# EAGLE design motor-driver-VNH23P30 TH (EAGLE 6.5.0)
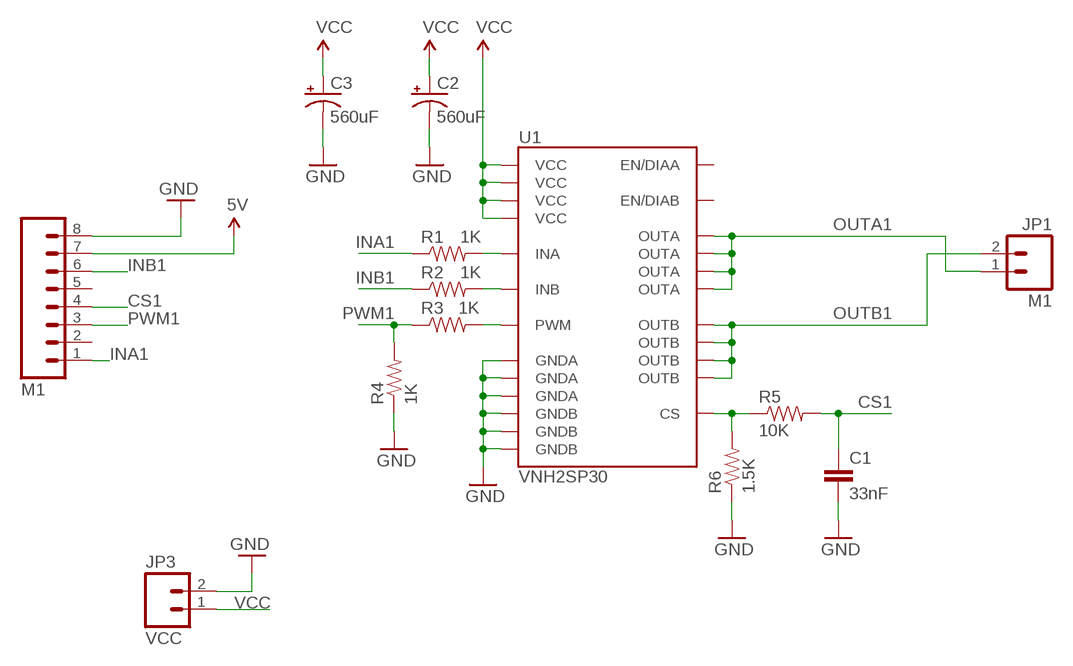
[diagram p0: schematic, sheet 1]

## Parts
C1  33nF  CAPEZ  [CAP-PTH-SMALLEZ]
C2  560uF  CAP_POLPTH4  [CPOL-RADIAL-1000UF-25V]
C3  560uF  CAP_POLPTH4  [CPOL-RADIAL-1000UF-25V]
JP1  M1  M02PTH4  [1X02_XTRA_BIG]
JP3  VCC  M02PTH4  [1X02_XTRA_BIG]
P  M1  M081X08  [1X08]
R1  1K  RESISTORPTH-1/6W  [1/6W-RES]
R2  1K  RESISTORPTH-1/6W  [1/6W-RES]
R3  1K  RESISTORPTH-1/6W  [1/6W-RES]
R4  1K  RESISTORPTH-1/6W  [1/6W-RES]
R5  10K  RESISTORPTH-1/6W  [1/6W-RES]
R6  1.5K  RESISTORPTH-1/6W  [1/6W-RES]
U1  VNH2SP30  [VNH2SP30]

## Nets
5V: P.7
CS1: C1.1 P.4 R5.2
GND: C1.2 C2.2(-) C3.2(-) JP3.2 P.8 R4.1 R6.1 U1.18(GNDB) U1.19(GNDB) U1.20(GNDB) U1.26(GNDA) U1.27(GNDA) U1.28(GNDA)
INA1: P.1 R1.1
INB1: P.6 R2.1
N$1: R2.2 U1.11(INB)
N$2: R1.2 U1.5(INA)
N$5: R3.2 U1.8(PWM)
N$7: R5.1 R6.2 U1.9(CS)
OUTA1: JP1.1 U1.1(OUTA) U1.25(OUTA) U1.30(OUTA) U1.SLUG3(OUTA)
OUTB1: JP1.2 U1.15(OUTB) U1.16(OUTB) U1.21(OUTB) U1.SLUG2(OUTB)
PWM1: P.3 R3.1 R4.2
VCC: C2.1(+) C3.1(+) JP3.1 U1.3(VCC) U1.13(VCC) U1.23(VCC) U1.SLUG1(VCC)
Unconnected: P.2 P.5 U1.6(EN/DIAA) U1.10(EN/DIAB)

## Library data of the parts
C1 = SparkFun-Passives:CAP: Capacitor Standard 0603 ceramic capacitor, and 0.1" leaded capacitor.
C2 C3 = SparkFun:CAP_POL: Capacitor Polarized These are standard SMD and PTH capacitors. Normally 10uF, 47uF, and 100uF in electrolytic and tantalum varieties. Always verify the external diameter of the through hole cap, it varies with capacity, voltage, and manufacturer. The EIA devices should be standard.
JP1 JP3 = SparkFun:M02: Header 2 Standard 2-pin 0.1" header. Use with straight break away headers (SKU : PRT-00116), right angle break away headers (PRT-00553), swiss pins (PRT-00743), machine pins (PRT-00117), and female headers (PRT-00115). Molex polarized connector foot print use with SKU : PRT-08233 with associated crimp pins and housings.
P = SparkFun:M08: Header 8 Standard 8-pin 0.1" header. Use with straight break away headers (SKU : PRT-00116), right angle break away headers (PRT-00553), swiss pins (PRT-00743), machine pins (PRT-00117), and female headers (PRT-00115).
R1-R6 = SparkFun-Passives:RESISTOR: Resistor Basic schematic elements and footprints for 0603, 1206, and PTH resistors.
U1 = SparkFun:VNH2SP30

## Board
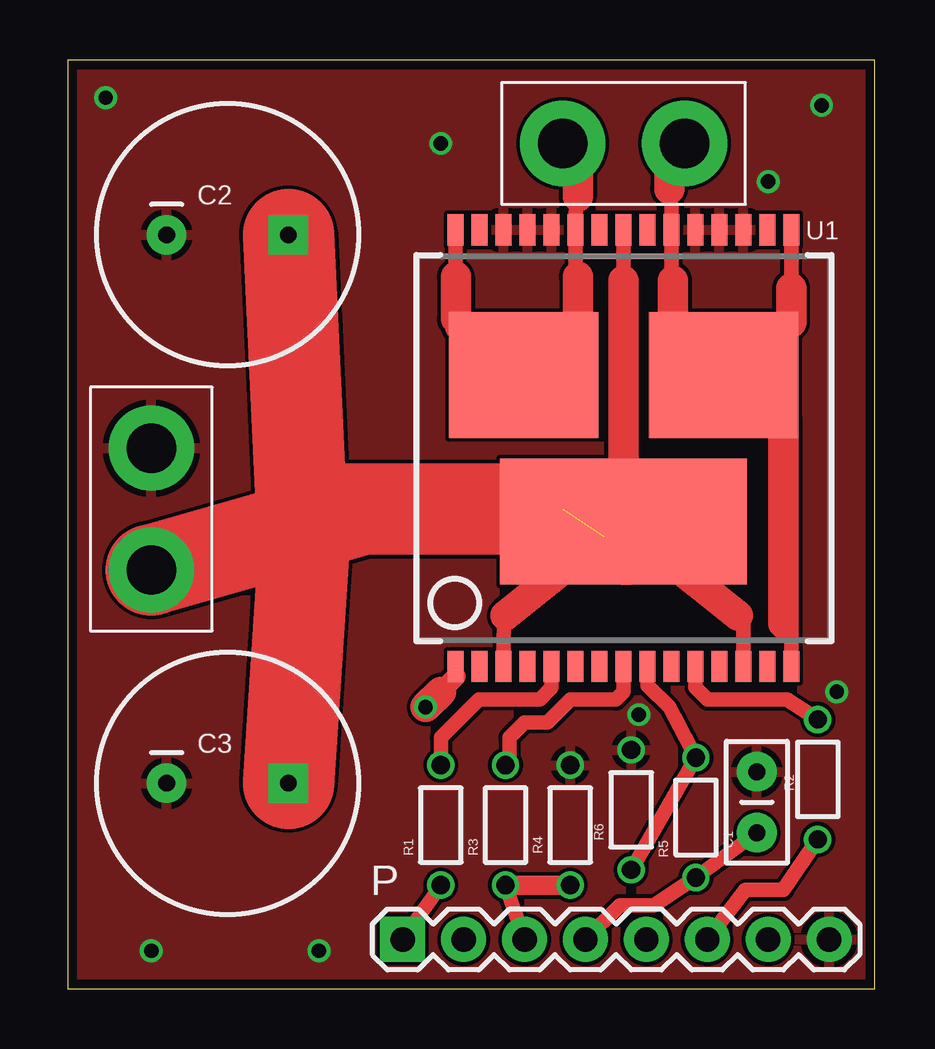
[diagram p1: board, top side]
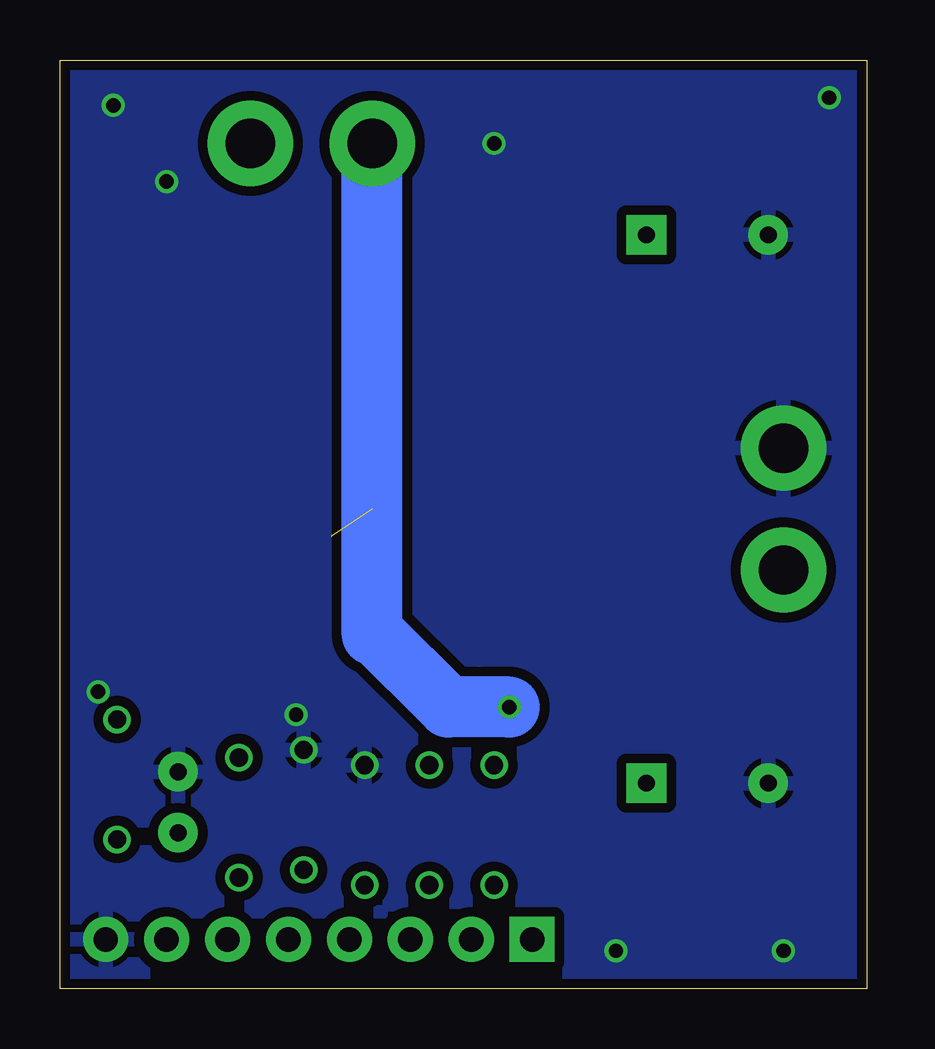
[diagram p2: board, bottom side, seen from below]

Size 33.65 x 38.72 mm. Coordinates in mm from the lower left corner, seen from the top.
Outline: 33.65,0 33.65,38.72 0,38.72 0,0 33.65,0
Copper layers (1*16): Top 0.0356mm / dielectric 1.5011mm / Bottom 0.0356mm
Design rules "default": minimum track width 6mil, minimum drill 13mil, track to track 6mil, track to pad 6mil, pad to pad 6mil, via to via 6mil, smd to smd 6mil, copper to edge 15mil, drill to drill 6mil, minimum pad ring 7mil, minimum via ring 7mil, stop-mask expansion 4mil, vias tented up to drill 0mil, thermal gap 10mil

### Footprints (pad centres in the part's own frame; a part is rotated, then mirrored left to right if it is on the bottom)
CAP-PTH-SMALLEZ = drill 0.7 pad 1.651: 1 0,0; 2 2.54,0
CPOL-RADIAL-1000UF-25V = drill 0.7 pad 1.651 square: 1 2.54,0 | drill 0.7 pad 1.651: 2 -2.54,0
1X02_XTRA_BIG = drill 2.057 pad 3.556: 1 -2.54,0; 2 2.54,0
1X08 = drill 1.016 pad 1.88 square: 1 0,0 | drill 1.016 pad 1.88: 2 2.54,0; 3 5.08,0; 4 7.62,0; 5 10.16,0; 6 12.7,0; 7 15.24,0; 8 17.78,0
1/6W-RES = drill 0.762: 1 -2.5,0; 2 2.5,0
VNH2SP30 = smd 0.67 x 1.3: 1 -7,-9.1; 2 -6,-9.1; 3 -5,-9.1; 4 -4,-9.1; 5 -3,-9.1; 6 -2,-9.1; 7 -1,-9.1; 8 0,-9.1; 9 1,-9.1; 10 2,-9.1; 11 3,-9.1; 12 4,-9.1; 13 5,-9.1; 14 6,-9.1; 15 7,-9.1; 16 7,9.1; 17 6,9.1; 18 5,9.1; 19 4,9.1; 20 3,9.1; 21 2,9.1; 22 1,9.1; 23 0,9.1; 24 -1,9.1; 25 -2,9.1; 26 -3,9.1; 27 -4,9.1; 28 -5,9.1; 29 -6,9.1; 30 -7,9.1 | smd 10.3 x 5.25: SLUG1 0,-3.05 | smd 6.23 x 5.25: SLUG2 4.165,3.05; SLUG3 -4.165,3.05

### Placement (x,y rotation side)
C1  28.72,6.51 90 top
C2  6.66,31.43 0 top
C3  6.66,8.57 0 top
JP1  23.17,35.24 0 top
JP3  3.48,20 90 top
P  13.96,2.06 0 top
R1  15.55,6.83 90 top
R2  31.26,8.73 90 top
R3  18.25,6.83 90 top
R4  20.95,6.83 270 top
R5  26.18,7.14 270 top
R6  23.48,7.46 270 top
U1  23.17,22.54 0 top

### Tracks (layer width: path | path; a pad name or v marks a point on that pad's centre or on a via)
CS1
  Top 0.61: C1.1 R5.2 24.44,3.49 23.01,3.49 P.4
GND  (via drill 0.6)
  other vias: 31.42,36.83 29.2,33.66 1.58,37.15 15.55,35.24 3.48,1.59 32.06,12.38 10.47,1.59 23.8,11.43
  pour Bottom (isolate 0.406): 0.31,38.42 0.31,0.32 33.33,0.32 33.33,38.42
  pour Top: 33.49,38.58 0.15,38.58 0.15,0.16 33.49,0.16
INA1
  Top 0.61: P.1 R1.1
INB1
  Top 0.61: P.6 28.25,4.13 29.84,4.13 R2.1
N$1
  Top 0.61: U1.11 26.17,12.56 26.66,12.07 29.97,12.07 R2.2
N$2
  Top 0.61: U1.5 20.17,12.56 19.67,12.07 17.14,12.07 15.55,10.48 R1.2
N$5
  Top 0.61: U1.8 23.17,12.38 22.85,12.07 20.94,12.07 19.99,11.11 19.04,11.11 18.41,10.48 18.41,9.66 R3.2
N$7
  Top 0.61: U1.9 24.17,12.65 25.07,11.75 R5.1 R6.2
OUTA1  (via drill 0.6)  (1 unrouted)
  Top 0.406: U1.1 16.18,13.02
  Top 0.61: 21.17,27.12 U1.SLUG3 | U1.30 16.17,29.7 16.18,29.69 | 21.26,29.69 21.17,29.78 U1.25 21.17,32.29 21.26,33.02
  Top 0.813: 16.18,13.02 15.55,12.38
  Top 1.27: JP1.1 21.26,34.61 21.26,33.02 | 16.18,29.69 16.18,27.94 16.34,27.78 16.34,27.62 U1.SLUG3 19.76,25.72 20.63,25.72 21.26,26.35 21.26,29.69 | 15.55,12.38 v14.91,11.75
  Bottom 2.54: 20.63,14.76 20.63,14.92 | 20.63,14.92 JP1.1 | v14.91,11.75 17.45,11.75 20.63,14.92
OUTB1
  Top 0.61: 25.07,33.34 25.17,32.61 U1.21 25.17,29.59 25.23,29.53 | 30.15,29.21 30.17,29.23 U1.16 | 29.84,15.24 30.17,15.54 U1.15
  Top 1.27: JP1.2 25.07,34.61 25.07,33.34 | 25.23,29.53 25.23,26.99 26.34,25.88 26.41,25.88 U1.SLUG2 | U1.SLUG2 30.15,27.78 30.15,29.21 | U1.SLUG2 29.84,23.73 29.84,15.24
PWM1
  Top 0.61: P.3 R3.1
  Top 0.813: R3.1 R4.2
VCC  (1 unrouted)
  Top 0.61: U1.3 18.17,14.68 18.25,15.56 | 28.17,13.73 U1.13 28.17,15.32 27.93,15.56 | 23.8,18.73 23.8,18.22 23.55,19.11 U1.SLUG1 | U1.23 23.17,29.53
  Top 1.27: 23.17,29.53 U1.SLUG1 22.34,18.86 18.25,15.56 | 23.8,18.73 24.76,18.1 27.93,15.56
  Top 3.81: 23.29,18.73 23.55,19.11 | C2.1 9.83,18.1 | 9.83,18.1 9.83,20 12.37,20 | 12.37,20 20.63,20 | JP3.1 12.37,20 | C3.1 9.83,18.1